# EAGLE schematic DummyLoad (EAGLE 8.6.3)
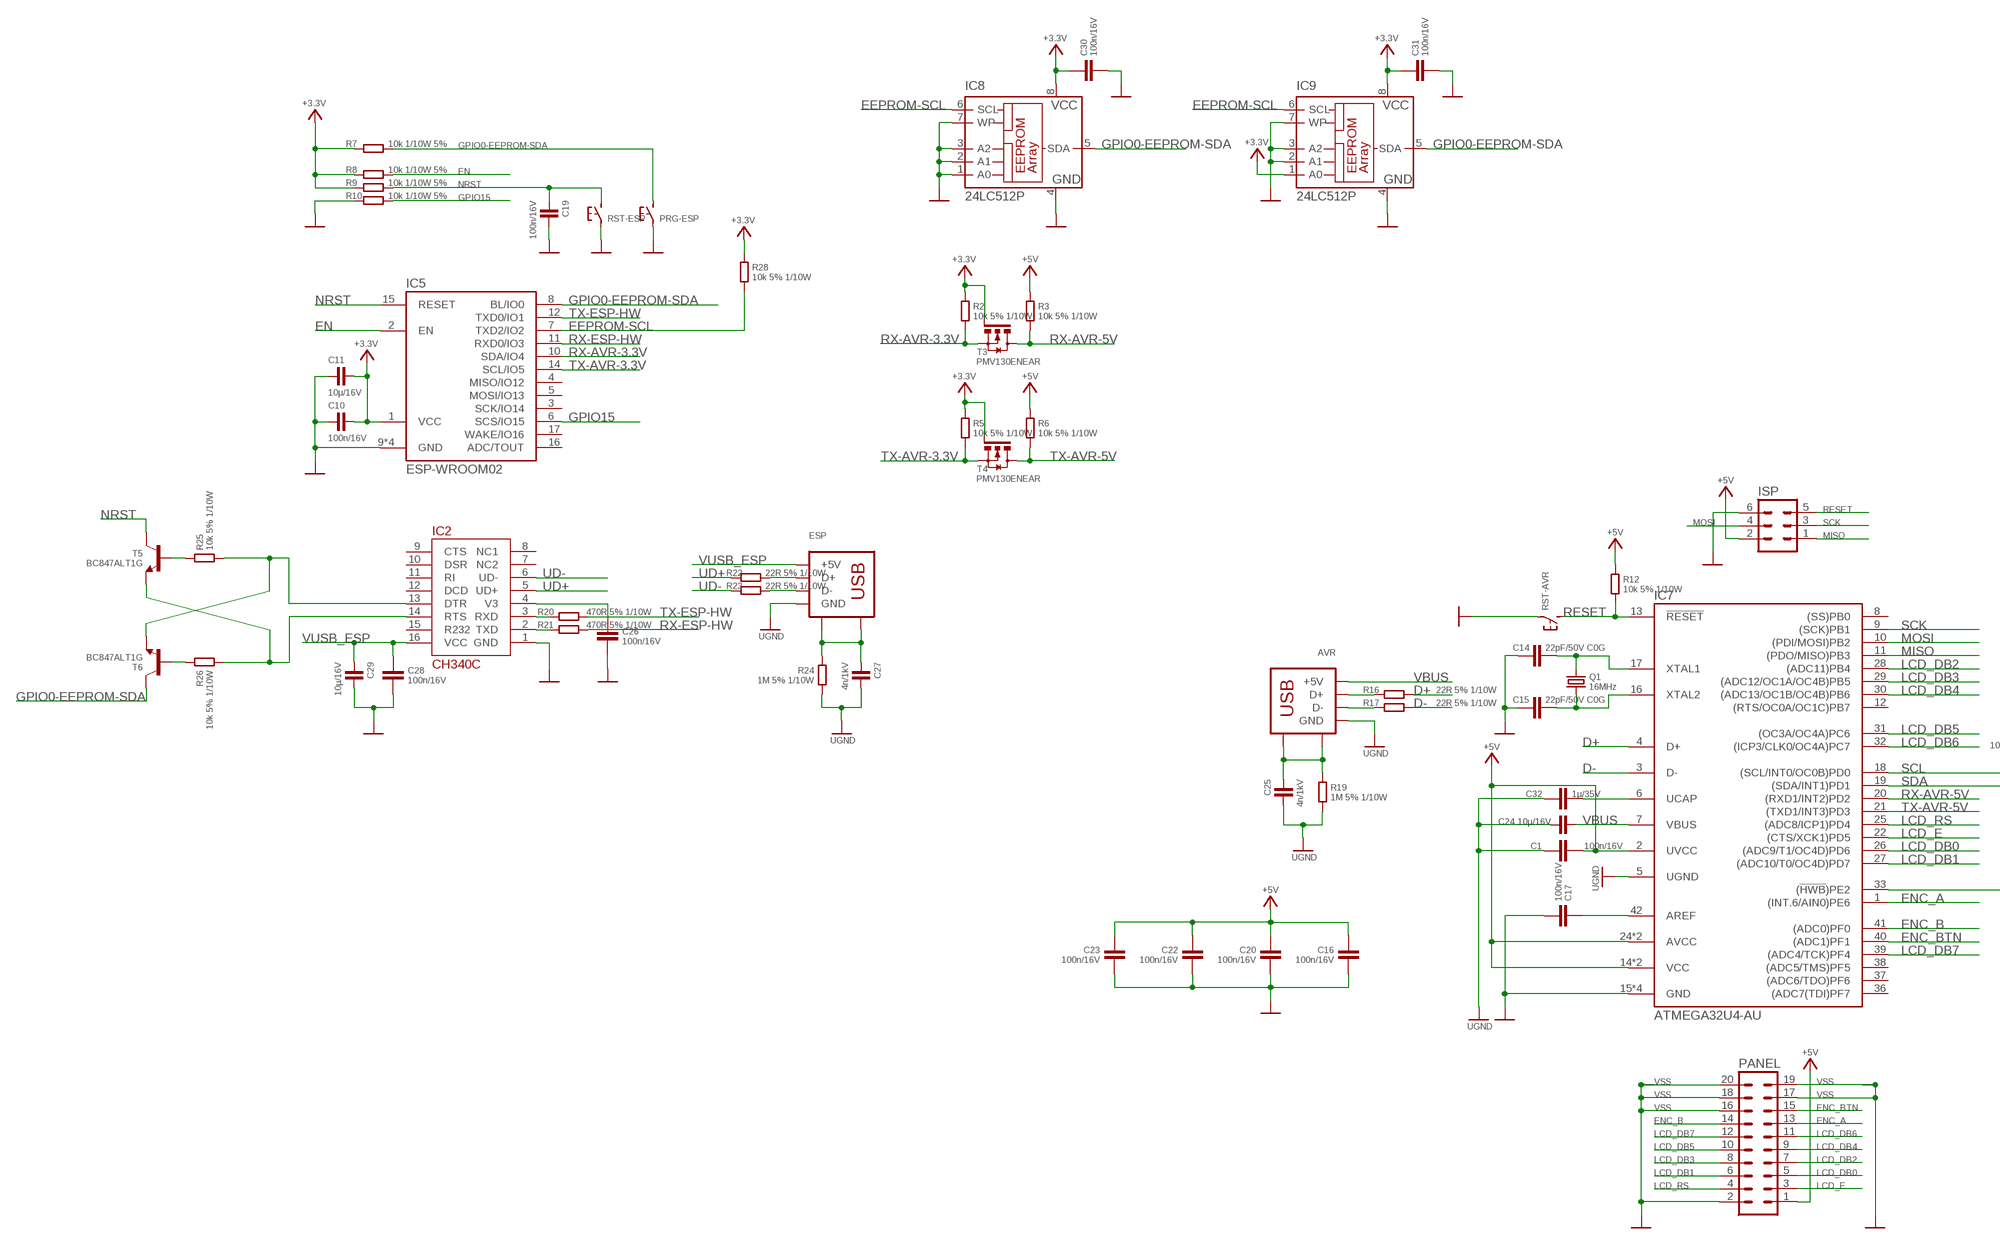
[diagram p0: schematic, sheet 1, part 1 of 2]
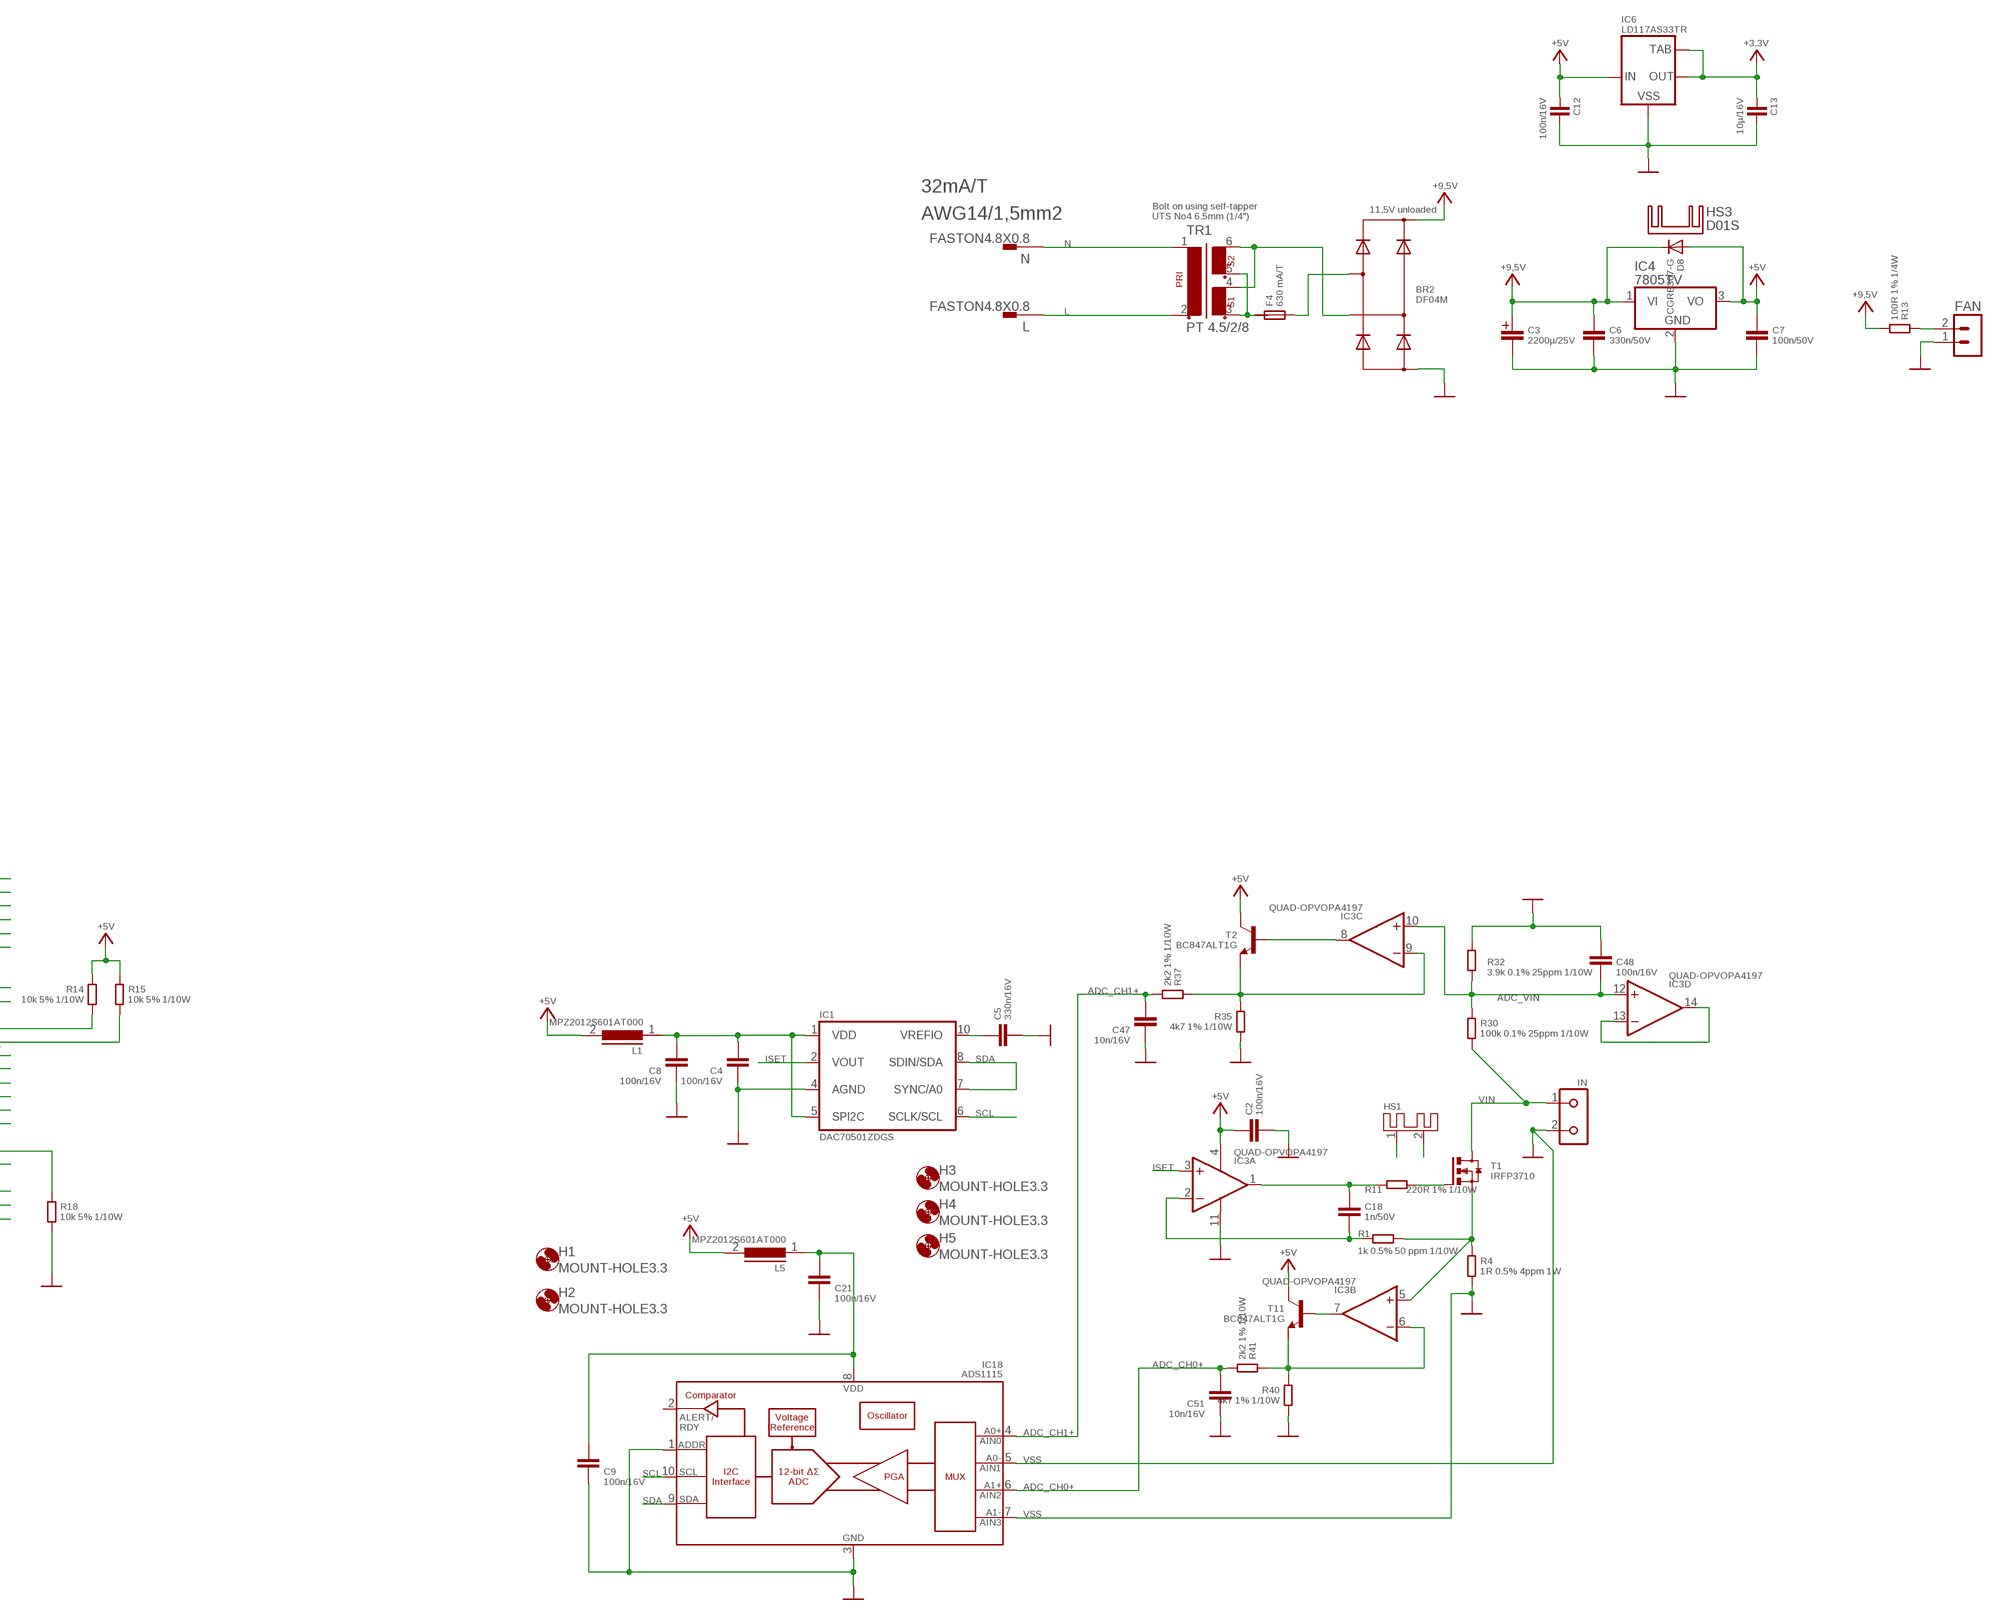
[diagram p1: schematic, sheet 1, part 2 of 2]

## Parts
AVR  USBUSB-B  [USB-B]
BR2  DF04M  BRDIL2  [BR-DIL2]
C1  100n/16V  CC/0805  [0805]
C2  100n/16V  CC/0805  [0805]
C3  2200µ/25V  C+5/12.5  [C+/5/12.5]
C4  100n/16V  CC/0805  [0805]
C5  330n/16V  CC/0805  [0805]
C6  330n/50V  CC/0805  [0805]
C7  100n/50V  CC/0805  [0805]
C8  100n/16V  CC/0805  [0805]
C9  100n/16V  CC/0805  [0805]
C10  100n/16V  CAPACITOR-0805  [C0805]
C11  10µ/16V  CAPACITOR-1210  [C1210]
C12  100n/16V  CAPACITOR-0805  [C0805]
C13  10µ/16V  CAPACITOR-1210  [C1210]
C14  22pF/50V C0G  CC/0805  [0805]
C15  22pF/50V C0G  CC/0805  [0805]
C16  100n/16V  CC/0805  [0805]
C17  100n/16V  CC/0805  [0805]
C18  1n/50V  CC/0805  [0805]
C19  100n/16V  CAPACITOR-0805  [C0805]
C20  100n/16V  CC/0805  [0805]
C21  100n/16V  CC/0805  [0805]
C22  100n/16V  CC/0805  [0805]
C23  100n/16V  CC/0805  [0805]
C24  10µ/16V  CAPACITOR-1210  [C1210]
C25  4n/1kV  CAPACITOR-1206  [C1206]
C26  100n/16V  CC/0805  [0805]
C27  4n/1kV  CAPACITOR-1206  [C1206]
C28  100n/16V  CC/0805  [0805]
C29  10µ/16V  CAPACITOR-1210  [C1210]
C30  100n/16V  CC/0805  [0805]
C31  100n/16V  CC/0805  [0805]
C32  1µ/35V  CC/0805  [0805]
C47  10n/16V  CC/0805  [0805]
C48  100n/16V  CC/0805  [0805]
C51  10n/16V  CC/0805  [0805]
D8  CGRB307-G  DWIDE  [DO214AA-CGRB307-G]
ESP  USBUSB-B  [USB-B]
F4  630 mA/T  F5X20  [F5X20]
FAN  JST-PH-2.0-2P  [JST-PH-2.0-2P]
H1  MOUNT-HOLE3.3  [3,3]
H2  MOUNT-HOLE3.3  [3,3]
H3  MOUNT-HOLE3.3  [3,3]
H4  MOUNT-HOLE3.3  [3,3]
H5  MOUNT-HOLE3.3  [3,3]
HS1  HSCR201-50  [CR201-50]
HS3  D01S  [D01S]
IC1  DAC70501ZDGS  DAC70501  [VSSOP10]
IC2  CH340C  [SOP16]
IC3  QUAD-OPVOPA4197  [SO14]
IC4  7805TV  [TO220V]
IC5  ESP-WROOM02  [ESP-WROOM02]
IC6  LD117AS33TR  [SOT223]
IC7  ATMEGA32U4-AU  [TQFP44]
IC8  24LC512P  24LC256P  [DIL8]
IC9  24LC512P  24LC256P  [DIL8]
IC18  ADS1115  ADS1015VSSOP10  [VSSOP10]
IN  KL2691311500002  [KL2-691311500002]
ISP  ML6  [ML6]
L  FASTON4.8X0.8  [FASTON-4.8X0.8]
L1  MPZ2012S601AT000  L0805  [C0805K@1]
L5  MPZ2012S601AT000  L0805  [C0805K@1]
N  FASTON4.8X0.8  [FASTON-4.8X0.8]
PANEL  MA10-2  [MA10-2]
PRG-ESP  TS1B3F-10XX  [B3F-10XX]
Q1  16MHz  Q5X3.2MM-TXC-7A-SERIES  [Q-5X3.2MM-TXC-7A.SERIES]
R1  1k 0.5% 50 ppm 1/10W  R-SMD0805  [C0805K]
R2  10k 5% 1/10W  R-SMD0805  [C0805K]
R3  10k 5% 1/10W  R-SMD0805  [C0805K]
R4  1R 0.5% 4ppm 1W  R-SHUNTVSR  [R-SHUNT-VSR]
R5  10k 5% 1/10W  R-SMD0805  [C0805K]
R6  10k 5% 1/10W  R-SMD0805  [C0805K]
R7  10k 1/10W 5%  R-SMD0805  [C0805K]
R8  10k 1/10W 5%  R-SMD0805  [C0805K]
R9  10k 1/10W 5%  R-SMD0805  [C0805K]
R10  10k 1/10W 5%  R-SMD0805  [C0805K]
R11  220R 1% 1/10W  R-SMD0805  [C0805K]
R12  10k 5% 1/10W  R-SMD0805  [C0805K]
R13  100R 1% 1/4W  R-SMD0805  [C0805K]
R14  10k 5% 1/10W  R-SMD0805  [C0805K]
R15  10k 5% 1/10W  R-SMD0805  [C0805K]
R16  22R 5% 1/10W  R-SMD0805  [C0805K]
R17  22R 5% 1/10W  R-SMD0805  [C0805K]
R18  10k 5% 1/10W  R-SMD0805  [C0805K]
R19  1M 5% 1/10W  R-SMD0805  [C0805K]
R20  470R 5% 1/10W  R-SMD0805  [C0805K]
R21  470R 5% 1/10W  R-SMD0805  [C0805K]
R22  22R 5% 1/10W  R-SMD0805  [C0805K]
R23  22R 5% 1/10W  R-SMD0805  [C0805K]
R24  1M 5% 1/10W  R-SMD0805  [C0805K]
R25  10k 5% 1/10W  R-SMD0805  [C0805K]
R26  10k 5% 1/10W  R-SMD0805  [C0805K]
R28  10k 5% 1/10W  R-SMD0805  [C0805K]
R30  100k 0.1% 25ppm 1/10W  R-SMD0805  [C0805K]
R32  3.9k 0.1% 25ppm 1/10W  R-SMD0805  [C0805K]
R35  4k7 1% 1/10W  R-SMD0805  [C0805K]
R37  2k2 1% 1/10W  R-SMD0805  [C0805K]
R40  4k7 1% 1/10W  R-SMD0805  [C0805K]
R41  2k2 1% 1/10W  R-SMD0805  [C0805K]
RST-AVR  TS1B3F-10XX  [B3F-10XX]
RST-ESP  TS1B3F-10XX  [B3F-10XX]
T1  IRFP3710  T-NMOSTO247  [TOP3AV]
T2  BC847ALT1G  T-NPNSOT23-BEC  [SOT23-BEC]
T3  PMV130ENEAR  T-NMOSIRLML2502PBF  [SOT23]
T4  PMV130ENEAR  T-NMOSIRLML2502PBF  [SOT23]
T5  BC847ALT1G  T-NPNSOT23-BEC  [SOT23-BEC]
T6  BC847ALT1G  T-NPNSOT23-BEC  [SOT23-BEC]
T11  BC847ALT1G  T-NPNSOT23-BEC  [SOT23-BEC]
TR1  PT 4.5/2/8  PT4,5/2/..  [PT/4,5/2/..]

## Nets
+3.3V: C10.2 C11.2 C13.1 C30.1 C31.1 IC5.1(VCC) IC6.2(OUT) IC6.4(OUT1) IC8.8(VCC) IC9.1(A0) IC9.8(VCC) R2.1 R5.1 R7.1 R8.1 R9.1 R28.1 T3.1(G) T4.1(G)
+5V: C1.2 C2.1 C7.1 C12.1 C16.1 C20.1 C22.1 C23.1 D8.A IC3.4(PWR:V+) IC4.3(VO) IC6.3(IN) IC7.2(UVCC) IC7.14(VCC) IC7.24(AVCC) IC7.34(VCC) IC7.44(AVCC) ISP.2 L1.2 L5.2 PANEL.1 R3.1 R6.1 R12.1 R14.1 R15.1 T2.C T11.C
+9,5V: BR2.DC+ C3.+ C6.1 D8.C IC4.1(VI) R13.2
ADC_CH0+: C51.1 IC18.6(AIN2) R41.2
ADC_CH1+: C47.1 IC18.4(AIN0) R37.2
ADC_VIN: C48.2 IC3.10(C:+IN) IC3.12(D:+IN) R30.1 R32.2
D+: IC7.4(D+) R16.1
D-: IC7.3(D-) R17.1
EEPROM-SCL: IC5.7(TXD2/IO2) IC8.6(SCL) IC9.6(SCL) R28.2
EN: IC5.2(EN) R8.2
ENC_A: IC7.1((INT.6/AIN0)PE6) PANEL.13
ENC_B: IC7.41((ADC0)PF0) PANEL.14
ENC_BTN: IC7.40((ADC1)PF1) PANEL.15
GPIO0-EEPROM-SDA: IC5.8(BL/IO0) IC8.5(SDA) IC9.5(SDA) PRG-ESP.3 R7.2 T6.C
GPIO15: IC5.6(SCS/IO15) R10.2
ISET: IC1.2(VOUT) IC3.3(A:+IN)
L: L.A1 L.A2 TR1.2
LCD_DB0: IC7.26((ADC9/T1/OC4D)PD6) PANEL.5
LCD_DB1: IC7.27((ADC10/T0/OC4D)PD7) PANEL.6
LCD_DB2: IC7.28((ADC11)PB4) PANEL.7
LCD_DB3: IC7.29((ADC12/OC1A/OC4B)PB5) PANEL.8
LCD_DB4: IC7.30((ADC13/OC1B/OC4B)PB6) PANEL.9
LCD_DB5: IC7.31((OC3A/OC4A)PC6) PANEL.10
LCD_DB6: IC7.32((ICP3/CLK0/OC4A)PC7) PANEL.11
LCD_DB7: IC7.39((ADC4/TCK)PF4) PANEL.12
LCD_E: IC7.22((CTS/XCK1)PD5) PANEL.3
LCD_RS: IC7.25((ADC8/ICP1)PD4) PANEL.4
MISO: IC7.11((PDO/MISO)PB3) ISP.1
MOSI: IC7.10((PDI/MOSI)PB2) ISP.4
N: N.A1 N.A2 TR1.1
N$1: C18.1 IC3.1(A:OUT) R11.1
N$2: IC3.7(B:OUT) T11.B
N$3: C17.1 IC7.42(AREF)
N$4: C18.2 IC3.2(A:-IN) R1.2
N$5: IC3.5(B:+IN) R1.1 R4.1 T1.E(S)
N$6: C9.1 C21.1 IC18.8(VDD) L5.1
N$7: C5.1 IC1.10(VREFIO)
N$8: IC3.8(C:OUT) T2.B
N$9: IC3.13(D:-IN) IC3.14(D:OUT)
N$10: AVR.D+ R16.2
N$11: AVR.D- R17.2
N$12: R11.2 T1.B(G)
N$13: C32.2 IC7.6(UCAP)
N$14: C14.2 IC7.17(XTAL1) Q1.2
N$15: C15.2 IC7.16(XTAL2) Q1.1
N$16: IC7.33((!HWB!)PE2) R18.1
N$17: AVR.SH1 AVR.SH2 C25.1 R19.1
N$18: C26.1 IC2.4(V3)
N$19: IC2.3(RXD) R20.1
N$20: IC2.2(TXD) R21.1
N$21: ESP.D+ R22.2
N$22: ESP.D- R23.2
N$23: C27.1 ESP.SH1 ESP.SH2 R24.1
N$24: R25.1 T5.B
N$25: R26.1 T6.B
N$27: BR2.AC1 F4.3 F4.4
N$28: IC2.14(RTS) R26.2 T5.E
N$29: IC2.13(DTR) R25.2 T6.E
N$30: HS1.1
N$31: HS1.2
N$33: F4.1 F4.2 TR1.3 TR1.5
N$34: BR2.AC2 TR1.4 TR1.6
N$35: FAN.2 R13.1
N$41: IC3.9(C:-IN) R35.1 R37.1 T2.E
N$45: IC3.6(B:-IN) R40.1 R41.1 T11.E
NRST: C19.1 IC5.15(RESET) R9.2 RST-ESP.3 T5.C
RESET: IC7.13(!RESET) ISP.5 R12.2 RST-AVR.3
RX-AVR-3.3V: IC5.10(SDA/IO4) R2.2 T3.2(S)
RX-AVR-5V: IC7.20((RXD1/INT2)PD2) R3.2 T3.3(D)
RX-ESP-HW: IC5.11(RXD0/IO3) R21.2
SCK: IC7.9((SCK)PB1) ISP.3
SCL: IC1.6(SCLK/SCL) IC7.18((SCL/INT0/OC0B)PD0) IC18.10(SCL) R14.2
SDA: IC1.7(SYNC/A0) IC1.8(SDIN/SDA) IC7.19((SDA/INT1)PD1) IC18.9(SDA) R15.2
TX-AVR-3.3V: IC5.14(SCL/IO5) R5.2 T4.2(S)
TX-AVR-5V: IC7.21((TXD1/INT3)PD3) R6.2 T4.3(D)
TX-ESP-HW: IC5.12(TXD0/IO1) R20.2
UD+: IC2.5(UD+) R22.1
UD-: IC2.6(UD-) R23.1
UGND: AVR.GND C1.1 C24.1 C25.2 C27.2 C32.1 ESP.GND IC7.5(UGND) R19.2 R24.2
VBUS: AVR.+5V C24.2 IC7.7(VBUS)
VDD: C4.1 C8.1 IC1.1(VDD) IC1.5(SPI2C) L1.1
VIN: IN.1 R30.2 T1.C(D)
VSS: BR2.DC- C2.2 C3.- C4.2 C5.2 C6.2 C7.2 C8.2 C9.2 C10.1 C11.1 C12.2 C13.2 C14.1 C15.1 C16.2 C17.2 C19.2 C20.2 C21.2 C22.2 C23.2 C26.2 C28.2 C29.2 C30.2 C31.2 C47.2 C48.1 C51.2 FAN.1 IC1.4(AGND) IC2.1(GND) IC3.11(PWR:V-) IC4.2(GND) IC5.9(GND) IC5.13(GND) IC5.18(GND) IC5.TP(GND) IC6.1(VSS) IC7.15(GND) IC7.23(GND) IC7.35(GND) IC7.43(GND) IC8.1(A0) IC8.2(A1) IC8.3(A2) IC8.4(GND) IC8.7(WP) IC9.2(A1) IC9.3(A2) IC9.4(GND) IC9.7(WP) IC18.1(ADDR) IC18.3(VSS) IC18.5(AIN1) IC18.7(AIN3) IN.2 ISP.6 PANEL.2 PANEL.16 PANEL.17 PANEL.18 PANEL.19 PANEL.20 PRG-ESP.1 R4.2 R10.1 R18.2 R32.1 R35.2 R40.2 RST-AVR.1 RST-ESP.1
VUSB_ESP: C28.1 C29.1 ESP.+5V IC2.16(VCC)
Unconnected: IC2.7(NC2) IC2.8(NC1) IC2.9(CTS) IC2.10(DSR) IC2.11(RI) IC2.12(DCD) IC2.15(R232) IC5.3(SCK/IO14) IC5.4(MISO/IO12) IC5.5(MOSI/IO13) IC5.16(ADC/TOUT) IC5.17(WAKE/IO16) IC7.8((SS)PB0) IC7.12((RTS/OC0A/OC1C)PB7) IC7.36((ADC7(TDI)PF7) IC7.37((ADC6/TDO)PF6) IC7.38((ADC5/TMS)PF5) IC18.2(ALERT/RDY)

## Notes on the sheet
- 32mA/T
- 11,5V unloaded
- AWG14/1,5mm2
- Bolt on using self-tapper
  UTS No4 6.5mm (1/4")

## Library data of the parts
AVR ESP = goujine-connectors:USB; OC_RS: 674-1328
BR2 = goujine:BR; OC_MOUSER: 621-DF04M; OC_MOUSER_ALT: 512-DF04M
C1 C2 C4 C7-C9 C16 C17 C20-C23 C26 C28 C30 C31 C48 = goujine:C: Kondensator; OC_MOUSER: 810-C2012X7R2A104K
C3 = neumluc:C+; OC_MOUSER: 667-EEU-FS1E222
C5 C6 = goujine:C: Kondensator; OC_MOUSER: 80-C0805C334K5RECTU
C10 C12 C19 = neumluc:CAPACITOR: Capacitors ...2.2uF @ 6.3V -> 0402 ...4.7uF @ 6.3V -> 0603 ...10uF @ 16V -> 0805 ...22uF @ 25V -> 1206; OC_MOUSER: 810-C2012X7R2A104K
C11 C13 C24 C29 = neumluc:CAPACITOR: Capacitors ...2.2uF @ 6.3V -> 0402 ...4.7uF @ 6.3V -> 0603 ...10uF @ 16V -> 0805 ...22uF @ 25V -> 1206; OC_MOUSER: 963-UMK316BBJ106KL-T
C14 C15 = goujine:C: Kondensator; OC_MOUSER: 603-CC805JRNPO9BN220
C18 = goujine:C: Kondensator; OC_MOUSER: 603-CC805KRX7R0BB102
C25 C27 = neumluc:CAPACITOR: Capacitors ...2.2uF @ 6.3V -> 0402 ...4.7uF @ 6.3V -> 0603 ...10uF @ 16V -> 0805 ...22uF @ 25V -> 1206; OC_MOUSER: 581-1206AC392K
C32 = goujine:C: Kondensator; OC_MOUSER: 963-UMK212B7105KG-T
C47 C51 = goujine:C: Kondensator; OC_MOUSER: 80-C0805C103K1R
D8 = neumluc:D; OC_MOUSER: 750-CGRB307-G
F4 = goujine:F: Sicherung; OC_MOUSER: 693-0751.0110
FAN = neumluc:JST-PH-2.0-2P: PIN HEADER; OC_DIGIKEY: 455-1704-ND; OC_MOUSER_ADD: 369-MF60251V21UA99
H1-H5 = holes:MOUNT-HOLE: MOUNTING HOLE with drill center marker
HS1 = neumluc:HS; OC_MOUSER: 588-CR201-50VE; OC_MOUSER_ADD: 588-CLA-TO-21E
HS3 = heatsink:D01S: HEATSINK distributor Schukat; OC_MOUSER: 532-576802B00
IC1 = neumluc:DAC70501; OC_MOUSER: 595-DAC70501ZDGS
IC2 = neumluc:CH340; OC_MOUSER: C84681
IC3 = neumluc:QUAD-OPV; OC_MOUSER: 595-OPA4197IDR
IC4 = linear:78*: Positive VOLTAGE REGULATOR Source: http://cache.national.com/ds/LM/LM78L05.pdf http://www.fairchildsemi.com/ds/LM/LM7805.pdf; OC_MOUSER: 511-L7805CV
IC5 = neumluc:ESP-WROOM02: Espressif ESP-WROOM-02 and AI-Thinker ESP-12 ESP8266 WiFi/WLAN Module; OC_MOUSER: 356-ESPWROOM02D(4MB)
IC6 = neumluc:LD117A?*: Low drop fixed and adjustable positive voltage regulators 1 A Source: http://www.st.com/stonline/products/literature/ds/7194/ld1117axx.pdf; OC_MOUSER: 511-LD1117AS33
IC7 = we-chip:ATMEGA32U4: Atmel ATmega16U4/32U4 AVR Microcontroller; OC_MOUSER: 556-ATMEGA32U4-AU
IC8 IC9 = microchip:24*: Serial EEPROM I2C; MF: MICROCHIP; MPN: 24LC256-E/P; OC_FARNELL: 9757970; OC_MOUSER: 579-24LC512-E/P; OC_NEWARK: 92C7169
IC18 = neumluc:ADS1015: ADS1015 12-BIT ADC 12-Bit Del-Sig ADC Four single-ended inputs or two differential inputs Internal PGA I2C interface 2.0-5.5V SparkFun Products SparkFun Block for Intel Edison - ADC <https://www.sparkfun.com/products/13770> (DEV-13770); OC_MOUSER: 595-ADS1115IDGSR
IN = neumluc:KL2: Printklemme 2-polig; OC_MOUSER: 710-691311500002; OC_MOUSER_ADD: 565-72912-2; OC_MOUSER_ADD2: 565-6883
ISP = neumluc:ML6: HARTING; OC_FARNELL: unknown; OC_MOUSER: 649-67996-406HLF; OC_NEWARK: unknown
L N = neumluc:FASTON: Flachstecker Typ Tyco/Electronics/AMP TAB, FASTON Printed Circuit Board Tabs Source: http://www.buerklin.com, http://catalog.tycoelectronics.com; OC_CONRAD: 736079; OC_CONRAD_ADD: 1022092; OC_FARNELL: unknown; OC_NEWARK: unknown
L1 L5 = neumluc:L: High Power Density, High Efficiency, Shielded Inductors; OC_MOUSER: 810-MPZ2012S601AT000
PANEL = con-lstb:MA10-2: PIN HEADER; OC_FARNELL: unknown; OC_MOUSER: 649-67996-420HLF; OC_NEWARK: unknown
PRG-ESP RST-AVR RST-ESP = neumluc:TS1; OC_MOUSER: 653-B3F-1022
Q1 = neumluc:Q; OC_MOUSER: 717-7A-16.000MAAJ-T
R1 = neumluc:R-SMD: R SMD; OC_MOUSER: 754-RR1220P-102D
R2 R3 R5-R10 R12 R14 R15 R18 R25 R26 R28 = neumluc:R-SMD: R SMD; OC_MOUSER: 652-CR0805-JW-103ELF
R4 = neumluc:R-SHUNT; OC_MOUSER: 71-VSRT1R0000DB
R11 R37 R41 = neumluc:R-SMD: R SMD; OC_MOUSER: 652-CR0805FX-2201ELF
R13 = neumluc:R-SMD: R SMD; OC_MOUSER: 660-RK73H2ATTD75R0F
R16 R17 R22 R23 = neumluc:R-SMD: R SMD; OC_MOUSER: 652-CR0805JW-220ELF
R19 R24 = neumluc:R-SMD: R SMD; OC_MOUSER: 652-CR0805JW-105ELF
R20 R21 = neumluc:R-SMD: R SMD; OC_MOUSER: 652-CR0805FX-4700ELF
R30 = neumluc:R-SMD: R SMD; OC_MOUSER: 754-RG2012P-104-B-T5
R32 = neumluc:R-SMD: R SMD; OC_MOUSER: 754-RG2012P-392-BT5
R35 R40 = neumluc:R-SMD: R SMD; OC_MOUSER: 652-CR0805FX-4701ELF
T1 = neumluc:T-NMOS: Transistor N-Channel MOSFET; OC_MOUSER: 942-IRFP3710PBF
T2 T5 T6 T11 = neumluc:T-NPN: NPN Transistor; OC_MOUSER: 863-BC847ALT1G
T3 T4 = neumluc:T-NMOS: Transistor N-Channel MOSFET; OC_MOUSER: 771-PMV130ENEAR
TR1 = neumluc:PT4,5/2/..: TRANSFORMER 1 primary winding, 1 secondary winding, mounting holes BLOCK; OC_RS: 201-8463; OC_RS_ADD: 546-5604